# EAGLE design plus-cartridge (EAGLE 5.10)
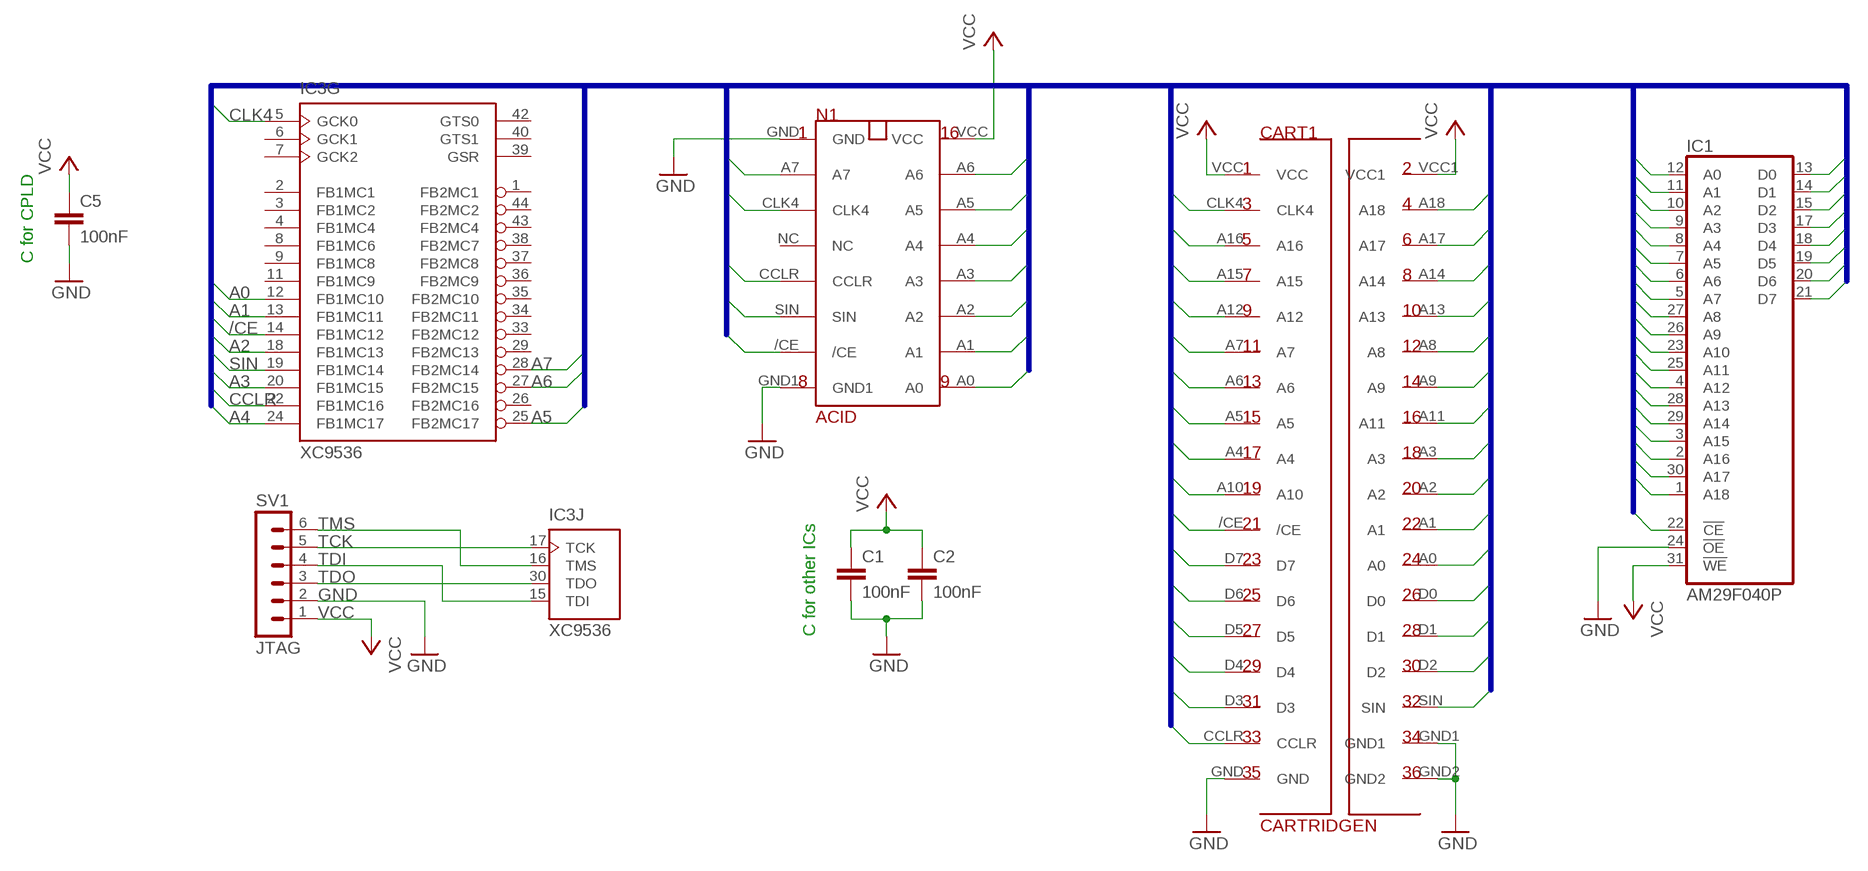
[diagram p0: schematic, sheet 1]

## Parts
C1  100nF  C-EU050-025X075  [C050-025X075]
C2  100nF  C-EU050-025X075  [C050-025X075]
C5  100nF  C-EU050-025X075  [C050-025X075]
CART1  CARTRIDGEN  [CARTRIDGE]
IC1  AM29F040P  [DIL32-3]
IC3  XC9536  XC9536-44  [PLCC-S44]
N1  ACID  [ACID]
SV1  JTAG  MA06-1  [MA06-1]

## Nets
/CE: CART1./CE IC1.22(!CE) IC3.14(G:FB1MC12) N1./CE
A0: CART1.A0 IC1.12(A0) IC3.12(G:FB1MC10) N1.A0
A1: CART1.A1 IC1.11(A1) IC3.13(G:FB1MC11) N1.A1
A2: CART1.A2 IC1.10(A2) IC3.18(G:FB1MC13) N1.A2
A3: CART1.A3 IC1.9(A3) IC3.20(G:FB1MC15) N1.A3
A4: CART1.A4 IC1.8(A4) IC3.24(G:FB1MC17) N1.A4
A5: CART1.A5 IC1.7(A5) IC3.25(G:FB2MC17) N1.A5
A6: CART1.A6 IC1.6(A6) IC3.27(G:FB2MC15) N1.A6
A7: CART1.A7 IC1.5(A7) IC3.28(G:FB2MC14) N1.A7
A8: CART1.A8 IC1.27(A8)
A9: CART1.A9 IC1.26(A9)
A10: CART1.A10 IC1.23(A10)
A11: CART1.A11 IC1.25(A11)
A12: CART1.A12 IC1.4(A12)
A13: CART1.A13 IC1.28(A13)
A14: CART1.A14 IC1.29(A14)
A15: CART1.A15 IC1.3(A15)
A16: CART1.A16 IC1.2(A16)
A17: CART1.A17 IC1.30(A17)
A18: CART1.A18 IC1.1(A18)
CCLR: CART1.CCLR IC3.22(G:FB1MC16) N1.CCLR
CLK4: CART1.CLK4 IC3.5(G:GCK0) N1.CLK4
D0: CART1.D0 IC1.13(D0)
D1: CART1.D1 IC1.14(D1)
D2: CART1.D2 IC1.15(D2)
D3: CART1.D3 IC1.17(D3)
D4: CART1.D4 IC1.18(D4)
D5: CART1.D5 IC1.19(D5)
D6: CART1.D6 IC1.20(D6)
D7: CART1.D7 IC1.21(D7)
GND: C1.2 C2.2 C5.2 CART1.GND CART1.GND1 CART1.GND2 IC1.24(!OE) N1.GND N1.GND1 SV1.2
SIN: CART1.SIN IC3.19(G:FB1MC14) N1.SIN
TCK: IC3.17(J:TCK) SV1.5
TDI: IC3.15(J:TDI) SV1.4
TDO: IC3.30(J:TDO) SV1.3
TMS: IC3.16(J:TMS) SV1.6
VCC: C1.1 C2.1 C5.1 CART1.VCC CART1.VCC1 IC1.31(!WE) N1.VCC SV1.1
Unconnected: IC3.1(G:FB2MC1) IC3.2(G:FB1MC1) IC3.3(G:FB1MC2) IC3.4(G:FB1MC4) IC3.6(G:GCK1) IC3.7(G:GCK2) IC3.8(G:FB1MC6) IC3.9(G:FB1MC8) IC3.11(G:FB1MC9) IC3.26(G:FB2MC16) IC3.29(G:FB2MC13) IC3.33(G:FB2MC12) IC3.34(G:FB2MC11) IC3.35(G:FB2MC10) IC3.36(G:FB2MC9) IC3.37(G:FB2MC8) IC3.38(G:FB2MC7) IC3.39(G:GSR) IC3.40(G:GTS1) IC3.42(G:GTS0) IC3.43(G:FB2MC4) IC3.44(G:FB2MC2) N1.NC

## Buses
D[0..7],A[0..18],/CE,/OE,/WE,CLK4,CCLR,SIN

## Notes on the sheet
- C for CPLD
- C for other ICs

## Power pins joined to a net without a drawn wire
GND: IC1.16(GND) IC3.10(P:GND) IC3.23(P:GND) IC3.31(P:GND)
VCC: IC1.32(VCC) IC3.21(P:VCC) IC3.32(P:VCC) IC3.41(P:VCC)

## Library data of the parts
C1 C2 C5 = rcl:C-EU: CAPACITOR, European symbol
CART1 = cpcplus-cartridge:CARTRIDGE
IC1 = am29-memory:AM29F040P: 4-Megabit FLASH MEMORY (512 K x 8 bit) 5 V-only
IC3 = XILINX:XC9536-44
N1 = cpcplus-cartridge:ACID
SV1 = con-lstb:MA06-1: PIN HEADER

## Board
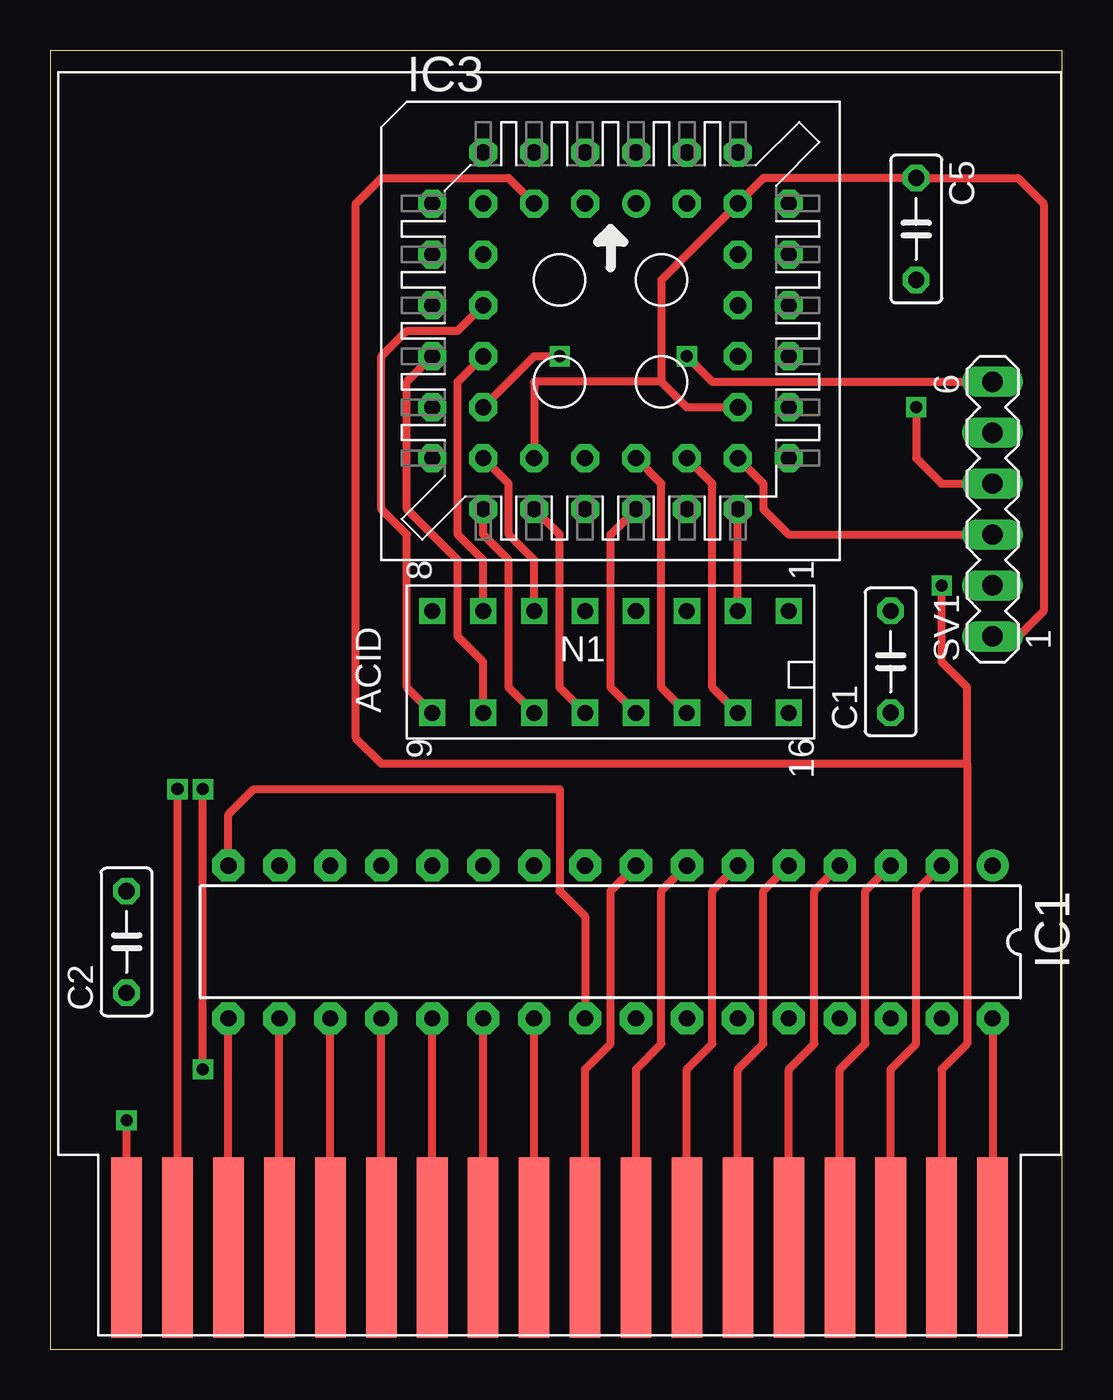
[diagram p1: board, top side]
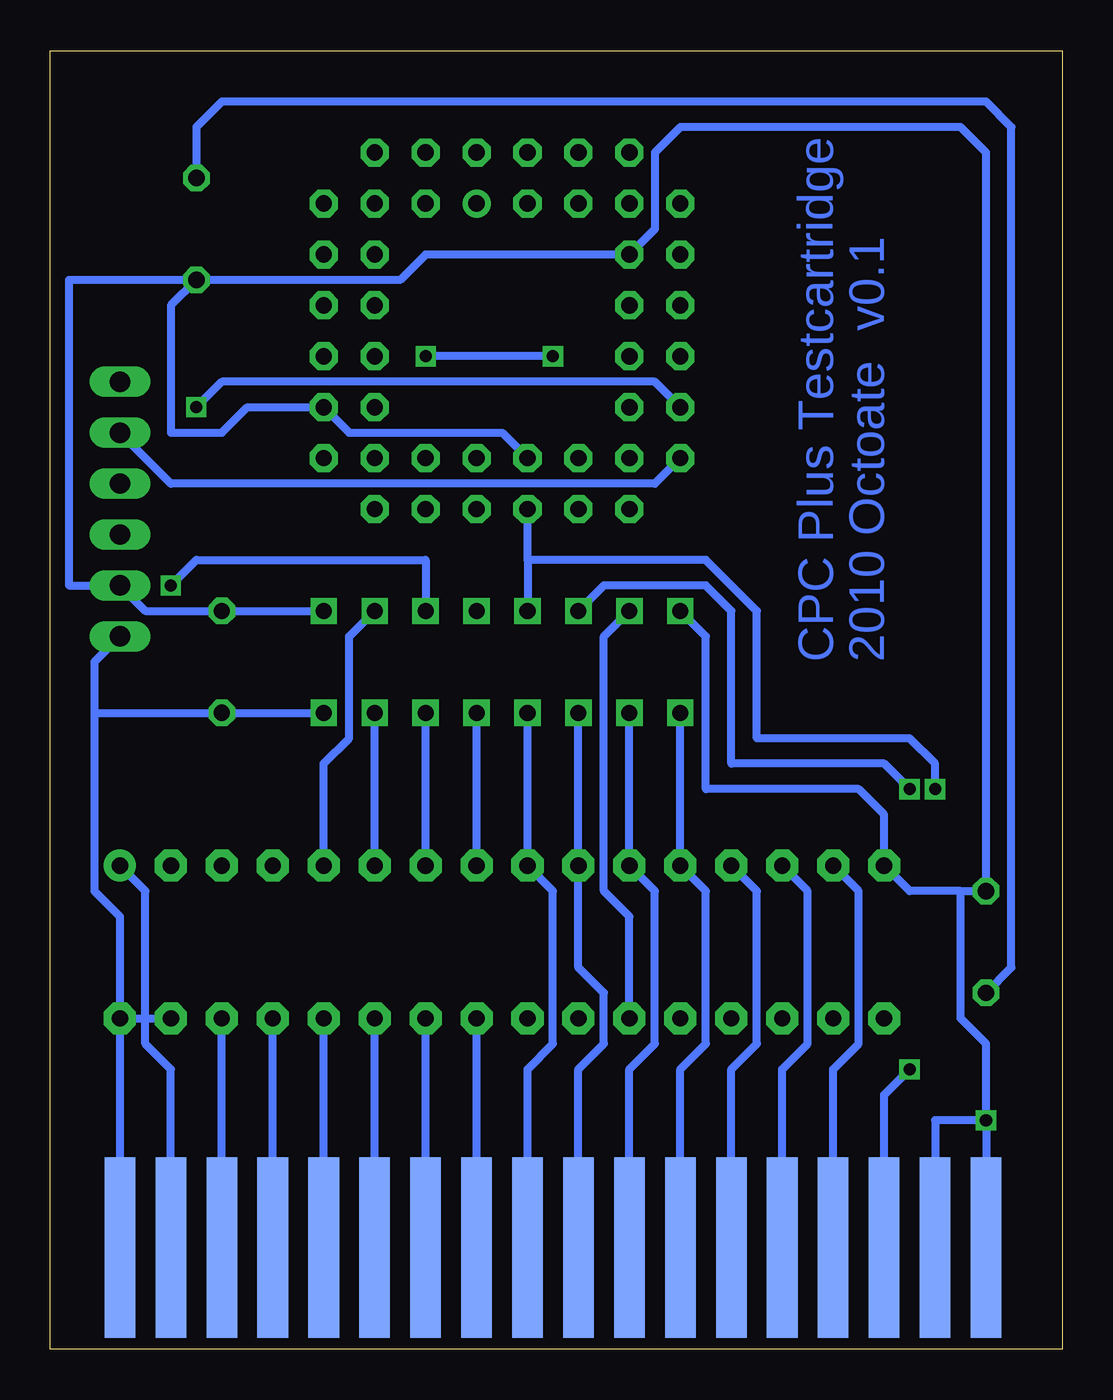
[diagram p2: board, bottom side, seen from below]

Size 50.47 x 64.76 mm. Coordinates in mm from the lower left corner, seen from the top.
Outline: 0,0 50.47,0 50.47,64.76 0,64.76 0,0
Copper layers (1*16): Top 0.035mm / dielectric 1.5mm / Bottom 0.035mm
Design rules "default": minimum track width 10mil, minimum drill 24mil, track to track 8mil, track to pad 8mil, pad to pad 8mil, via to via 8mil, smd to smd 8mil, copper to edge 40mil, drill to drill 8mil, minimum pad ring 10mil, minimum via ring 8mil, stop-mask expansion 4mil, vias tented up to drill 0mil, thermal gap 10mil

### Footprints (pad centres in the part's own frame; a part is rotated, then mirrored left to right if it is on the bottom)
C050-025X075 = drill 0.813 octagon: 1 -2.54,0; 2 2.54,0
CARTRIDGE = smd 1.524 x 8.992: /CE -3.81,-7.62; A4 1.27,-7.62; A5 3.81,-7.62; A6 6.35,-7.62; A7 8.89,-7.62; A10 -1.27,-7.62; A12 11.43,-7.62; A15 13.97,-7.62; A16 16.51,-7.62; CCLR -19.05,-7.62; CLK4 19.05,-7.62; D3 -16.51,-7.62; D4 -13.97,-7.62; D5 -11.43,-7.62; D6 -8.89,-7.62; D7 -6.35,-7.62; GND -21.59,-7.62; VCC 21.59,-7.62 | smd 1.524 x 8.992 bottom: A0 -6.35,-7.62; A1 -3.81,-7.62; A2 -1.27,-7.62; A3 1.27,-7.62; A8 8.89,-7.62; A9 6.35,-7.62; A11 3.81,-7.62; A13 11.43,-7.62; A14 13.97,-7.62; A17 16.51,-7.62; A18 19.05,-7.62; D0 -8.89,-7.62; D1 -11.43,-7.62; D2 -13.97,-7.62; GND1 -19.05,-7.62; GND2 -21.59,-7.62; SIN -16.51,-7.62; VCC1 21.59,-7.62
DIL32-3 = drill 0.813 pad 1.6 round: 1 -19.05,-3.81 | drill 0.813 pad 1.6 octagon: 2 -16.51,-3.81; 3 -13.97,-3.81; 4 -11.43,-3.81; 5 -8.89,-3.81; 6 -6.35,-3.81; 7 -3.81,-3.81; 8 -1.27,-3.81; 9 1.27,-3.81; 10 3.81,-3.81; 11 6.35,-3.81; 12 8.89,-3.81; 13 11.43,-3.81; 14 13.97,-3.81; 15 16.51,-3.81; 16 19.05,-3.81; 17 19.05,3.81; 18 16.51,3.81; 19 13.97,3.81; 20 11.43,3.81; 21 8.89,3.81; 22 6.35,3.81; 23 3.81,3.81; 24 1.27,3.81; 25 -1.27,3.81; 26 -3.81,3.81; 27 -6.35,3.81; 28 -8.89,3.81; 29 -11.43,3.81; 30 -13.97,3.81; 31 -16.51,3.81; 32 -19.05,3.81
PLCC-S44 = drill 0.813 pad 1.397 round: 1 1.27,6.35 | drill 0.813 pad 1.397 octagon: 2 -1.27,8.89; 3 -1.27,6.35; 4 -3.81,8.89; 5 -3.81,6.35; 6 -6.35,8.89; 7 -8.89,6.35; 8 -6.35,6.35; 9 -8.89,3.81; 10 -6.35,3.81; 11 -8.89,1.27; 12 -6.35,1.27; 13 -8.89,-1.27; 14 -6.35,-1.27; 15 -8.89,-3.81; 16 -6.35,-3.81; 17 -8.89,-6.35; 18 -6.35,-8.89; 19 -6.35,-6.35; 20 -3.81,-8.89; 21 -3.81,-6.35; 22 -1.27,-8.89; 23 -1.27,-6.35; 24 1.27,-8.89; 25 1.27,-6.35; 26 3.81,-8.89; 27 3.81,-6.35; 28 6.35,-8.89; 29 8.89,-6.35; 30 6.35,-6.35; 31 8.89,-3.81; 32 6.35,-3.81; 33 8.89,-1.27; 34 6.35,-1.27; 35 8.89,1.27; 36 6.35,1.27; 37 8.89,3.81; 38 6.35,3.81; 39 8.89,6.35; 40 6.35,8.89; 41 6.35,6.35; 42 3.81,8.89; 43 3.81,6.35; 44 1.27,8.89
ACID = drill 0.8 square: /CE -3.81,-6.35; A0 1.27,-8.89; A1 1.27,-6.35; A2 1.27,-3.81; A3 1.27,-1.27; A4 1.27,1.27; A5 1.27,3.81; A6 1.27,6.35; A7 -3.81,6.35; CCLR -3.81,-1.27; CLK4 -3.81,3.81; GND -3.81,8.89; GND1 -3.81,-8.89; NC -3.81,1.27; SIN -3.81,-3.81; VCC 1.27,8.89
MA06-1 = drill 1.016 long: 1 -6.35,0; 2 -3.81,0; 3 -1.27,0; 4 1.27,0; 5 3.81,0; 6 6.35,0

### Placement (x,y rotation side)
C1  41.91,34.29 90 top
C2  3.81,20.32 90 top
C5  43.18,55.88 270 top
CART1  25.4,12.7 0 top
IC1  27.94,20.32 180 top
IC3  27.94,50.8 0 top
N1  27.94,33.02 270 top
SV1  46.99,41.91 90 top

### Tracks (layer width: path | path; a pad name or v marks a point on that pad's centre or on a via)
/CE
  Top 0.406: CART1./CE IC1.22 | N1./CE 21.59,39.37 20.32,40.64 20.32,48.26 IC3.14
  Bottom 0.406: IC1.22 21.59,21.59 22.86,22.86 22.86,35.56 N1./CE
A0
  Top 0.406: N1.A0 17.78,33.02 17.78,40.64 16.51,41.91 16.51,49.53 17.78,50.8 20.32,50.8 IC3.12
  Bottom 0.406: N1.A0 IC1.12 17.78,22.86 17.78,15.24 19.05,13.97 CART1.A0
A1
  Top 0.406: N1.A1 21.59,34.29 20.32,35.56 20.32,39.37 17.78,41.91 17.78,48.26 IC3.13
  Bottom 0.406: CART1.A1 21.59,13.97 20.32,15.24 20.32,22.86 IC1.11 N1.A1
A2
  Top 0.406: N1.A2 22.86,33.02 22.86,39.37 21.59,40.64 IC3.18
  Bottom 0.406: N1.A2 IC1.10 24.13,19.05 22.86,17.78 22.86,15.24 24.13,13.97 CART1.A2
A3
  Top 0.406: N1.A3 25.4,33.02 25.4,40.64 IC3.20
  Bottom 0.406: N1.A3 IC1.9 25.4,22.86 25.4,15.24 26.67,13.97 CART1.A3
A4
  Top 0.406: CART1.A4 26.67,13.97 27.94,15.24 27.94,22.86 IC1.8 | IC3.24 27.94,40.64 27.94,33.02 N1.A4
  Bottom 0.406: IC1.8 N1.A4
A5
  Top 0.406: CART1.A5 29.21,13.97 30.48,15.24 30.48,22.86 IC1.7 | N1.A5 30.48,33.02 30.48,43.18 IC3.25
  Bottom 0.406: IC1.7 N1.A5
A6
  Top 0.406: CART1.A6 31.75,13.97 33.02,15.24 33.02,22.86 IC1.6 | N1.A6 33.02,33.02 33.02,43.18 IC3.27
  Bottom 0.406: IC1.6 N1.A6
A7
  Top 0.406: CART1.A7 34.29,13.97 35.56,15.24 35.56,22.86 IC1.5 | N1.A7 IC3.28
  Bottom 0.406: IC1.5 36.83,29.21 35.56,30.48 35.56,35.56 N1.A7
A8
  Bottom 0.406: CART1.A8 IC1.27
A9
  Bottom 0.406: CART1.A9 IC1.26
A10
  Top 0.406: CART1.A10 IC1.23
A11
  Bottom 0.406: CART1.A11 IC1.25
A12
  Top 0.406: CART1.A12 36.83,13.97 38.1,15.24 38.1,22.86 IC1.4
A13
  Bottom 0.406: CART1.A13 IC1.28
A14
  Bottom 0.406: CART1.A14 IC1.29
A15
  Top 0.406: CART1.A15 39.37,13.97 40.64,15.24 40.64,22.86 IC1.3
A16
  Top 0.406: CART1.A16 41.91,13.97 43.18,15.24 43.18,22.86 IC1.2
A17
  Bottom 0.406: CART1.A17 IC1.30
A18
  Bottom 0.406: CART1.A18 44.45,13.97 45.72,15.24 45.72,22.86 IC1.1
CCLR  (via drill 0.6)
  Top 0.406: CART1.CCLR v6.35,27.94
  Bottom 0.406: 26.67,39.37 N1.CCLR | 26.67,39.37 IC3.22 | v6.35,27.94 6.35,29.21 7.62,30.48 15.24,30.48 15.24,36.83 17.78,39.37 26.67,39.37
CLK4  (via drill 0.6)
  Top 0.406: CART1.CLK4 44.45,13.97 45.72,15.24 45.72,29.21 | 45.72,29.21 45.72,33.02 44.45,34.29 v44.45,38.1 | IC3.5 22.86,58.42 16.51,58.42 15.24,57.15 15.24,30.48 16.51,29.21 45.72,29.21
  Bottom 0.406: v44.45,38.1 43.18,39.37 31.75,39.37 N1.CLK4
D0
  Bottom 0.406: CART1.D0 16.51,13.97 15.24,15.24 15.24,22.86 IC1.13
D1
  Bottom 0.406: CART1.D1 13.97,13.97 12.7,15.24 12.7,22.86 IC1.14
D2
  Bottom 0.406: CART1.D2 11.43,13.97 10.16,15.24 10.16,22.86 IC1.15
D3
  Top 0.406: CART1.D3 IC1.17
D4
  Top 0.406: CART1.D4 IC1.18
D5
  Top 0.406: CART1.D5 IC1.19
D6
  Top 0.406: CART1.D6 IC1.20
D7
  Top 0.406: CART1.D7 IC1.21
GND  (via drill 0.6)
  Top 0.406: IC1.16 8.89,26.67 10.16,27.94 25.4,27.94 25.4,22.86 26.67,21.59 IC1.24 | CART1.GND v3.81,11.43
  Bottom 0.406: 5.08,22.86 C2.2 3.81,59.69 5.08,60.96 19.05,60.96 20.32,59.69 20.32,55.88 IC3.10 31.75,54.61 33.02,53.34 C5.2 | 5.08,22.86 7.62,22.86 IC1.16 8.89,26.67 10.16,27.94 17.78,27.94 17.78,35.56 N1.GND1 | 5.08,22.86 5.08,16.51 3.81,15.24 v3.81,11.43 | N1.GND C1.2 45.72,36.83 SV1.2 49.53,38.1 49.53,53.34 C5.2 | v3.81,11.43 CART1.GND | CART1.GND1 6.35,11.43 v3.81,11.43 | IC3.23 27.94,45.72 35.56,45.72 IC3.31 40.64,46.99 41.91,45.72 44.45,45.72 44.45,52.07 C5.2
SIN  (via drill 0.6)
  Top 0.406: v7.62,13.97 v7.62,27.94 | IC3.19 22.86,43.18 22.86,40.64 24.13,39.37 N1.SIN
  Bottom 0.406: N1.SIN 22.86,38.1 17.78,38.1 16.51,36.83 16.51,29.21 8.89,29.21 v7.62,27.94 | CART1.SIN 8.89,12.7 v7.62,13.97
TCK
  Bottom 0.406: IC3.17 20.32,43.18 44.45,43.18 SV1.5
TDI  (via drill 0.6)
  Top 0.406: v43.18,46.99 43.18,44.45 44.45,43.18 SV1.4
  Bottom 0.406: IC3.15 20.32,48.26 41.91,48.26 v43.18,46.99
TDO
  Top 0.406: SV1.3 36.83,40.64 35.56,41.91 35.56,43.18 IC3.30
TMS  (via drill 0.6)
  Top 0.406: IC3.16 24.13,49.53 v25.4,49.53 | SV1.6 33.02,48.26 v31.75,49.53
  Bottom 0.406: v25.4,49.53 v31.75,49.53
VCC
  Top 0.406: SV1.1 48.26,35.56 49.53,36.83 49.53,57.15 48.26,58.42 C5.1 35.56,58.42 IC3.41 30.48,53.34 30.48,48.26 | 30.48,48.26 24.13,48.26 IC3.21 | 30.48,48.26 31.75,46.99 IC3.32 | IC1.32 CART1.VCC1
  Bottom 0.406: IC1.32 46.99,21.59 48.26,22.86 48.26,31.75 | 48.26,31.75 48.26,34.29 SV1.1 | N1.VCC C1.1 48.26,31.75 | C2.1 2.54,19.05 2.54,60.96 3.81,62.23 41.91,62.23 43.18,60.96 C5.1 | IC1.32 IC1.31 | IC1.32 CART1.VCC1

### Text on the board
Bottom: v0.1 | 2010 Octoate | CPC Plus Testcartridge